# EAGLE schematic Load_Limiter_FPF2123 (EAGLE 6.5.0)
USB Load Limiter: FPF2123 FPF2123 Datasheet <https://www.fairchildsemi.com/ds/FP/FPF2124.pdf> This circuit takes in 5V from USB, protects it from surge currents (such as those from capacitances >10µF) and also prevents the device from powering the USB The 604Ω resistor limits to 570mA min, 950mA max, 760mA typica.l Note that the protecting diode causes a voltage drop. The output of this block will be less than 5V.
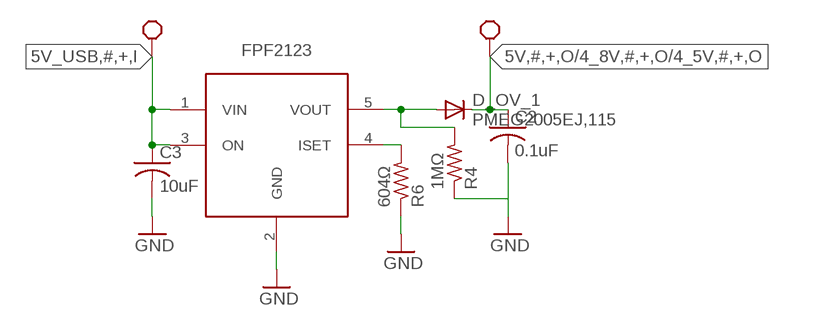
[diagram p0: schematic, sheet 1]

## Parts
C2  0.1uF  C-USC0603  [C0603]
C3  10uF  C-USC0603  [C0603]
D_OV_1  PMEG2005EJ,115  DIODE-SOD323-W  [SOD323-W]
FPF2123  FPF2123  [SOT23-5L]
R4  1MΩ  R-US_R0603  [R0603]
R6  604Ω  R-US_R0603  [R0603]

## Nets
5V,#,+,O/4_8V,#,+,O/4_5V,#,+,O: C2.1 D_OV_1.C ; supply symbol labelled BLOCK_REQUIREMENT
5V_USB,#,+,I: C3.1 FPF2123.1(VIN) FPF2123.3(ON) ; supply symbol labelled BLOCK_REQUIREMENT
GND: C2.2 C3.2 FPF2123.2(GND) R4.1 R6.1
LOAD_ISET_1: FPF2123.4(ISET) R6.2
N$17: D_OV_1.A FPF2123.5(VOUT) R4.2

## Library data of the parts
C2 C3 = resistor:C-US: CAPACITOR, American symbol
D_OV_1 = diode:DIODE-: DIODE
FPF2123 = neels:FPF2123
R4 R6 = resistor:R-US_: RESISTOR, American symbol

## Net classes
0 default: width 0.178 mm, drill 0.381 mm, clearance 0.178 mm